# EasyEDA schematic Nakuja Remix 3.json
TITLE: Sheet_1; REV: 1.0; Date: 2022-04-21; Sheet: 1/1; Drawn By: Rodney Osodo; Company: Your Company
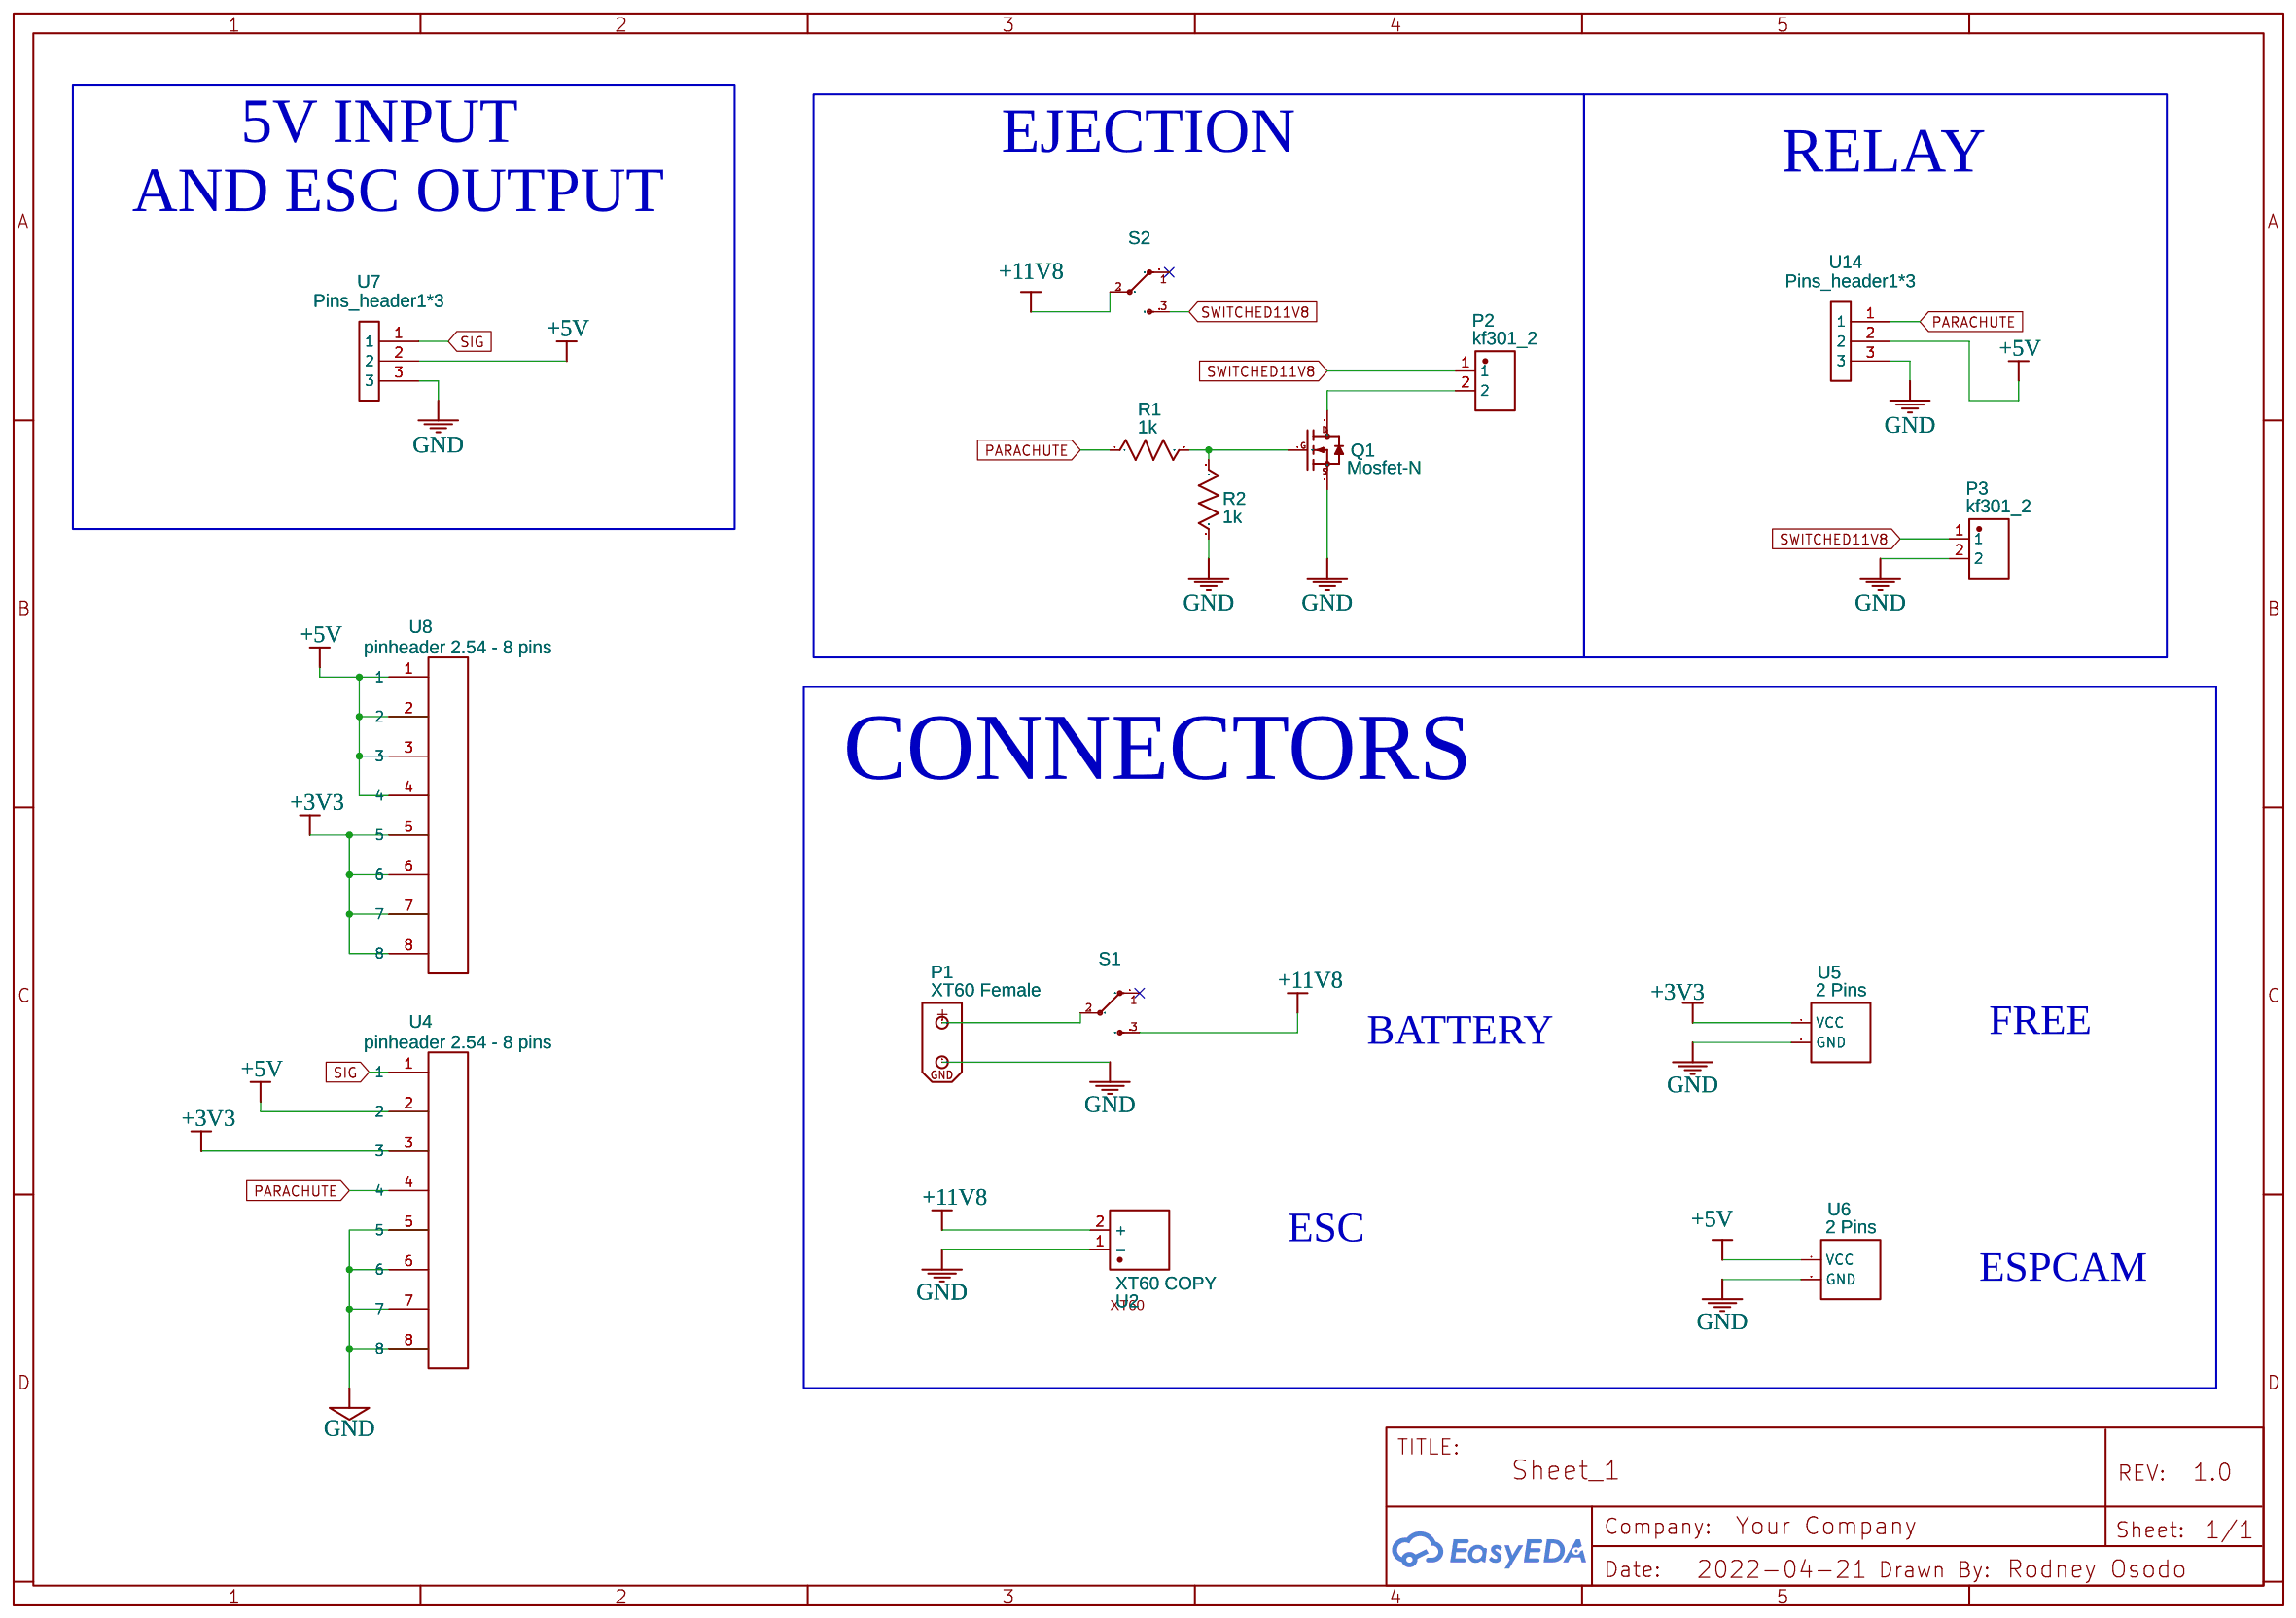
[diagram p0: schematic sheet]

## Parts
P1  XT60 Female  [XT60-F]
P2  kf301_2  [KF301_2P]
P3  kf301_2  [KF301_2P]
Q1  Mosfet-N  [DC-MOSFET-TO-220]
R1  1k  [R_AXIAL-0.6]
R2  1k  [R_AXIAL-0.6]
S1  TOGGLESWITCH SPST_SWITCH-SPDT  [TOGGLE SWITCH SPDT RED 3 PIN ON-OFF-ON 3 SPDT SMALL AC 6A/125V 3A/250V]
S2  TOGGLESWITCH SPST_SWITCH-SPDT  [TOGGLE SWITCH SPDT RED 3 PIN ON-OFF-ON 3 SPDT SMALL AC 6A/125V 3A/250V]
U2  XT60 COPY  [XT60]
U4  pinheader 2.54 - 8 pins  [PINHEADER 2.54 - 8 PINS]
U5  2 Pins  [2 PINS HEADER]
U6  2 Pins  [2 PINS HEADER]
U7  Pins_header1*3  [PINS_HEADER1*3]
U8  pinheader 2.54 - 8 pins  [PINHEADER 2.54 - 8 PINS]
U14  Pins_header1*3  [PINS_HEADER1*3]

## Library data of the parts
P1 = XT60 Female: Manufacturer: Changzhou Amass Elec; Contributor: rifanoz
P2 P3 = kf301_2: Manufacturer: BOOMELE; image: //image.lceda.cn/szlcsc/C33435.jpg; Supplier Part: C33435; Contributor: rusrobot
Q1 = Mosfet-N: Contributor: dina
R1 R2 = R_AXIAL-0.6_US: Contributor: LCEDA_Lib
S1 S2 = TOGGLESWITCH SPST_SWITCH-SPDT: sourceId: ceKgMGAuL; Contributor: matmatis
U2 = XT60 COPY: Contributor: Mitian
U4 U8 = pinheader 2.54 - 8 pins: Contributor: pramodsreelakam
U5 U6 = 2 Pins: Contributor: Uzain Yaseen
U7 U14 = Pins_header1*3: Contributor: Nattanan

## Nets
+3V3: U4.3 U5.1(VCC) U8.5 U8.6 U8.7 U8.8
+5V: U4.2 U6.1(VCC) U7.2 U8.1 U8.2 U8.3 U8.4 U14.2
+11V8: S1.3(S) S2.2(P) U2.2(+)
GND: P1.1 P3.2 Q1.3(S) R2.1 U2.1(-) U4.5 U4.6 U4.7 U4.8 U5.2(GND) U6.2(GND) U7.3 U14.3
PARACHUTE: R1.1 U4.4 U14.1
SIG: U4.1 U7.1
SWITCHED11V8: P2.1 P3.1 S2.3(S)
Net-(P1-2): P1.2 S1.2(P)
Net-(P2-2): P2.2 Q1.2(D)
Net-(Q1-1): Q1.1(G) R1.2 R2.2

Not connected (* = marked no-connect by the designer): S1 1(O)*; S2 1(O)*

## Notes on the sheet
- 5V INPUT
- EJECTION
- RELAY
- AND ESC OUTPUT
- CONNECTORS
- BATTERY
- FREE
- ESC
- ESPCAM
